# EAGLE design SmartPwm_v1 (EAGLE 9.6.2)
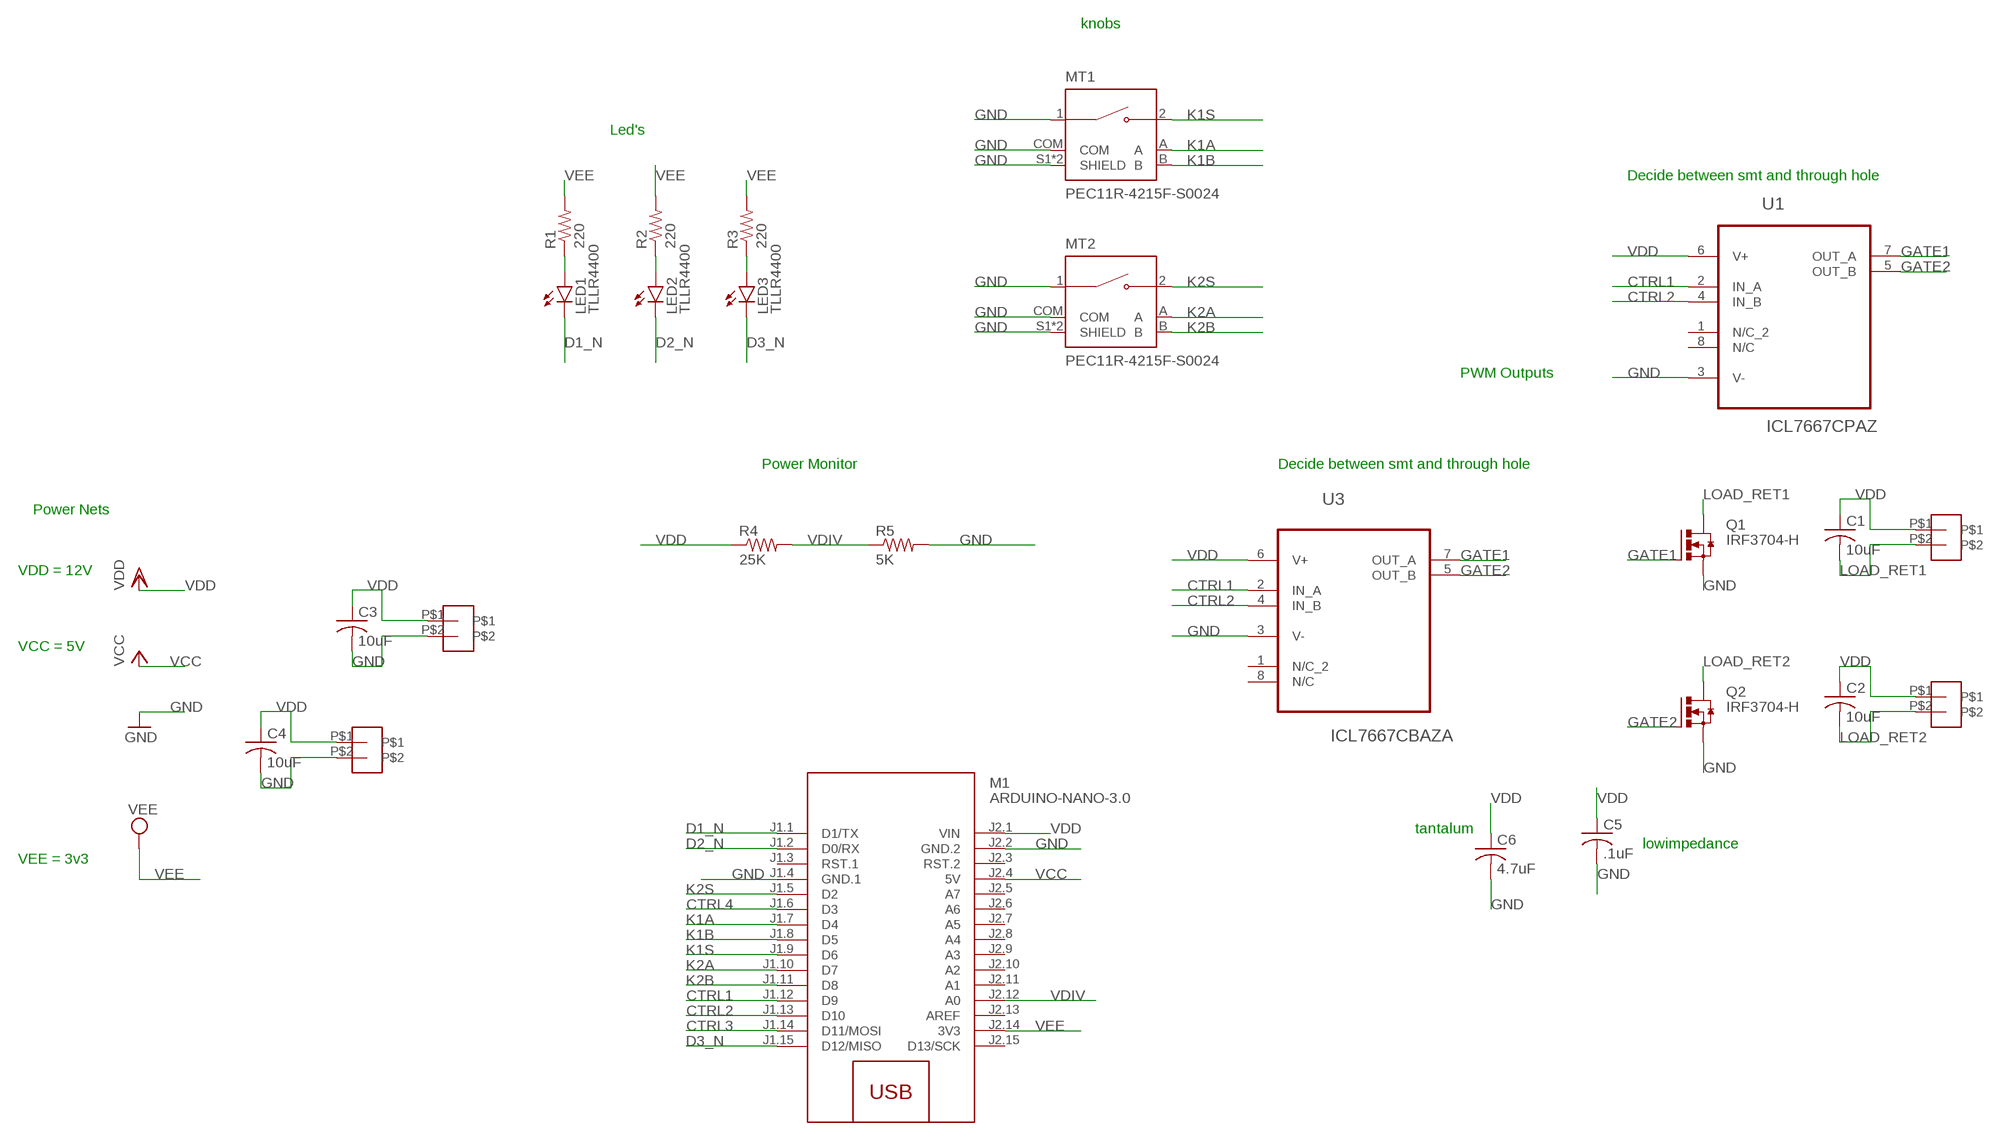
[diagram p0: schematic, sheet 1]

## Parts
C1  10uF  C-US025-024X044  [C025-024X044]
C2  10uF  C-US025-024X044  [C025-024X044]
C3  10uF  C-US025-024X044  [C025-024X044]
C4  10uF  C-US025-024X044  [C025-024X044]
C5  .1uF  C-US025-024X044  [C025-024X044]
C6  4.7uF  C-US025-024X044  [C025-024X044]
LED1  TLLR4400  [LED3MM]
LED2  TLLR4400  [LED3MM]
LED3  TLLR4400  [LED3MM]
M1  ARDUINO-NANO-3.0  [ARDUINO-NANO-3.0]
MT1  PEC11R-4215F-S0024  [XDCR_PEC11R-4215F-S0024]
MT2  PEC11R-4215F-S0024  [XDCR_PEC11R-4215F-S0024]
Q1  IRF3704-H  [TO220BH]
Q2  IRF3704-H  [TO220BH]
R1  220  R-US_0207/10  [0207/10]
R2  220  R-US_0207/10  [0207/10]
R3  220  R-US_0207/10  [0207/10]
R4  25K  R-US_0207/10  [0207/10]
R5  5K  R-US_0207/10  [0207/10]
U1  ICL7667CPAZ  [DIP254P762X533-8]
U3  ICL7667CBAZA  [SOIC127P600X175-8N]
U$1  TB002-500-P02  [TB002-500-P02]
U$2  TB002-500-P02  [TB002-500-P02]
U$5  TB002-500-P02  [TB002-500-P02]
U$8  TB002-500-P02  [TB002-500-P02]

## Nets
CTRL1: M1.J1.12(D9) U1.2(IN_A) U3.2(IN_A)
CTRL2: M1.J1.13(D10) U1.4(IN_B) U3.4(IN_B)
CTRL3: M1.J1.14(D11/MOSI)
CTRL4: M1.J1.6(D3)
D1_N: LED1.K(C) M1.J1.1(D1/TX)
D2_N: LED2.K(C) M1.J1.2(D0/RX)
D3_N: LED3.K(C) M1.J1.15(D12/MISO)
GATE1: Q1.G U1.7(OUT_A) U3.7(OUT_A)
GATE2: Q2.G U1.5(OUT_B) U3.5(OUT_B)
GND: C3.2 C4.2 C5.2 C6.2 M1.J1.4(GND.1) M1.J2.2(GND.2) MT1.1 MT1.COM MT1.S1(SHIELD) MT1.S2(SHIELD) MT2.1 MT2.COM MT2.S1(SHIELD) MT2.S2(SHIELD) Q1.S Q2.S R5.2 U1.3(V-) U3.3(V-) U$5.P$2 U$8.P$2
K1A: M1.J1.7(D4) MT1.A
K1B: M1.J1.8(D5) MT1.B
K1S: M1.J1.9(D6) MT1.2
K2A: M1.J1.10(D7) MT2.A
K2B: M1.J1.11(D8) MT2.B
K2S: M1.J1.5(D2) MT2.2
LOAD_RET1: C1.2 Q1.D U$1.P$2
LOAD_RET2: C2.2 Q2.D U$2.P$2
N$1: LED1.A R1.1
N$2: LED2.A R2.1
N$3: LED3.A R3.1
VCC: M1.J2.4(5V)
VDD: C1.1 C2.1 C3.1 C4.1 C5.1 C6.1 M1.J2.1(VIN) R4.1 U1.6(V+) U3.6(V+) U$1.P$1 U$2.P$1 U$5.P$1 U$8.P$1
VDIV: M1.J2.12(A0) R4.2 R5.1
VEE: M1.J2.14(3V3) R1.2 R2.2 R3.2
Unconnected: M1.J1.3(RST.1) M1.J2.3(RST.2) M1.J2.5(A7) M1.J2.6(A6) M1.J2.7(A5) M1.J2.8(A4) M1.J2.9(A3) M1.J2.10(A2) M1.J2.11(A1) M1.J2.13(AREF) M1.J2.15(D13/SCK) U1.1(N/C_2) U1.8(N/C) U3.1(N/C_2) U3.8(N/C)

## Notes on the sheet
- knobs
- Led's
- Decide between smt and through hole
- PWM Outputs
- Power Monitor | Decide between smt and through hole
- Power Nets
- VDD = 12V
- VCC = 5V
- tantalum
- lowimpedance
- VEE = 3v3

## Library data of the parts
C1-C6 = rcl:C-US: CAPACITOR, American symbol; SPICEPREFIX: C
LED1-LED3 = led:TLLR4400: Low Current (2mA) LED 3 mm Tinted Diffused Package color RED Source: Data sheet <http://www.farnell.com/datasheets/391100.pdf>; MF: VISHAY SEMICONDUCTOR; OC_FARNELL: 1612437
M1 = diy-modules:ARDUINO-NANO-3.0: Arduino Nano 3.0 and compatible devices More details available here: https://www.arduino.cc/en/Main/ArduinoBoardNano Click here to find device on ebay.com <http://www.ebay.com/sch/arduino+nano>
MT1 MT2 = PEC11R-4215F-S0024:PEC11R-4215F-S0024: Incremental Encoder, 12 Mm, Contact Rating 10 Ma - 5 Vdc Check prices <https://pricing.snapeda.com/parts/PEC11R-4215F-S0024/Bourns/view-part?ref=eda>; AVAILABILITY: In Stock; DESCRIPTION: Rotary Encoder Mechanical 24 Quadrature (Incremental) Vertical; MF: Bourns; MP: PEC11R-4215F-S0024; PACKAGE: None; PRICE: None; PURCHASE-URL: https://pricing.snapeda.com/search/part/PEC11R-4215F-S0024/?ref=eda
Q1 Q2 = transistor-power:IRF3704: SMPS MOSFET HEXFET® Power MOSFET Source: http://www.irf.com/product-info/datasheets/data/irf3704.pdf
R1-R5 = rcl:R-US_: RESISTOR, American symbol; SPICEPREFIX: R
U1 = ICL7667CPAZ:ICL7667CPAZ: Dual Power MOSFET Driver Check prices <https://pricing.snapeda.com/parts/ICL7667CPAZ/Renesas%20Electronics%20America%20Inc/view-part?ref=eda>; AVAILABILITY: In Stock; DESCRIPTION: High-Side or Low-Side Gate Driver IC Inverting 8-PDIP; MF: Renesas Electronics America Inc; MP: ICL7667CPAZ; PACKAGE: DIP-8 Renesas / Intersil; PRICE: None; PURCHASE-URL: https://pricing.snapeda.com/search/part/ICL7667CPAZ/?ref=eda
U3 = ICL7667CBAZA:ICL7667CBAZA: Dual Power MOSFET Driver Check prices <https://pricing.snapeda.com/parts/ICL7667CBAZA/Renesas%20Electronics%20America%20Inc/view-part?ref=eda>; AVAILABILITY: In Stock; DESCRIPTION: High-Side or Low-Side Gate Driver IC Inverting 8-SOIC; MF: Renesas Electronics America Inc; MP: ICL7667CBAZA; PACKAGE: SOIC-8 Renesas Electronics; PRICE: None; PURCHASE-URL: https://pricing.snapeda.com/search/part/ICL7667CBAZA/?ref=eda
U$1 U$2 U$5 U$8 = mylib:TB002-500-P02: Terminal Block. Screw Connection. Two Pole.

## Board
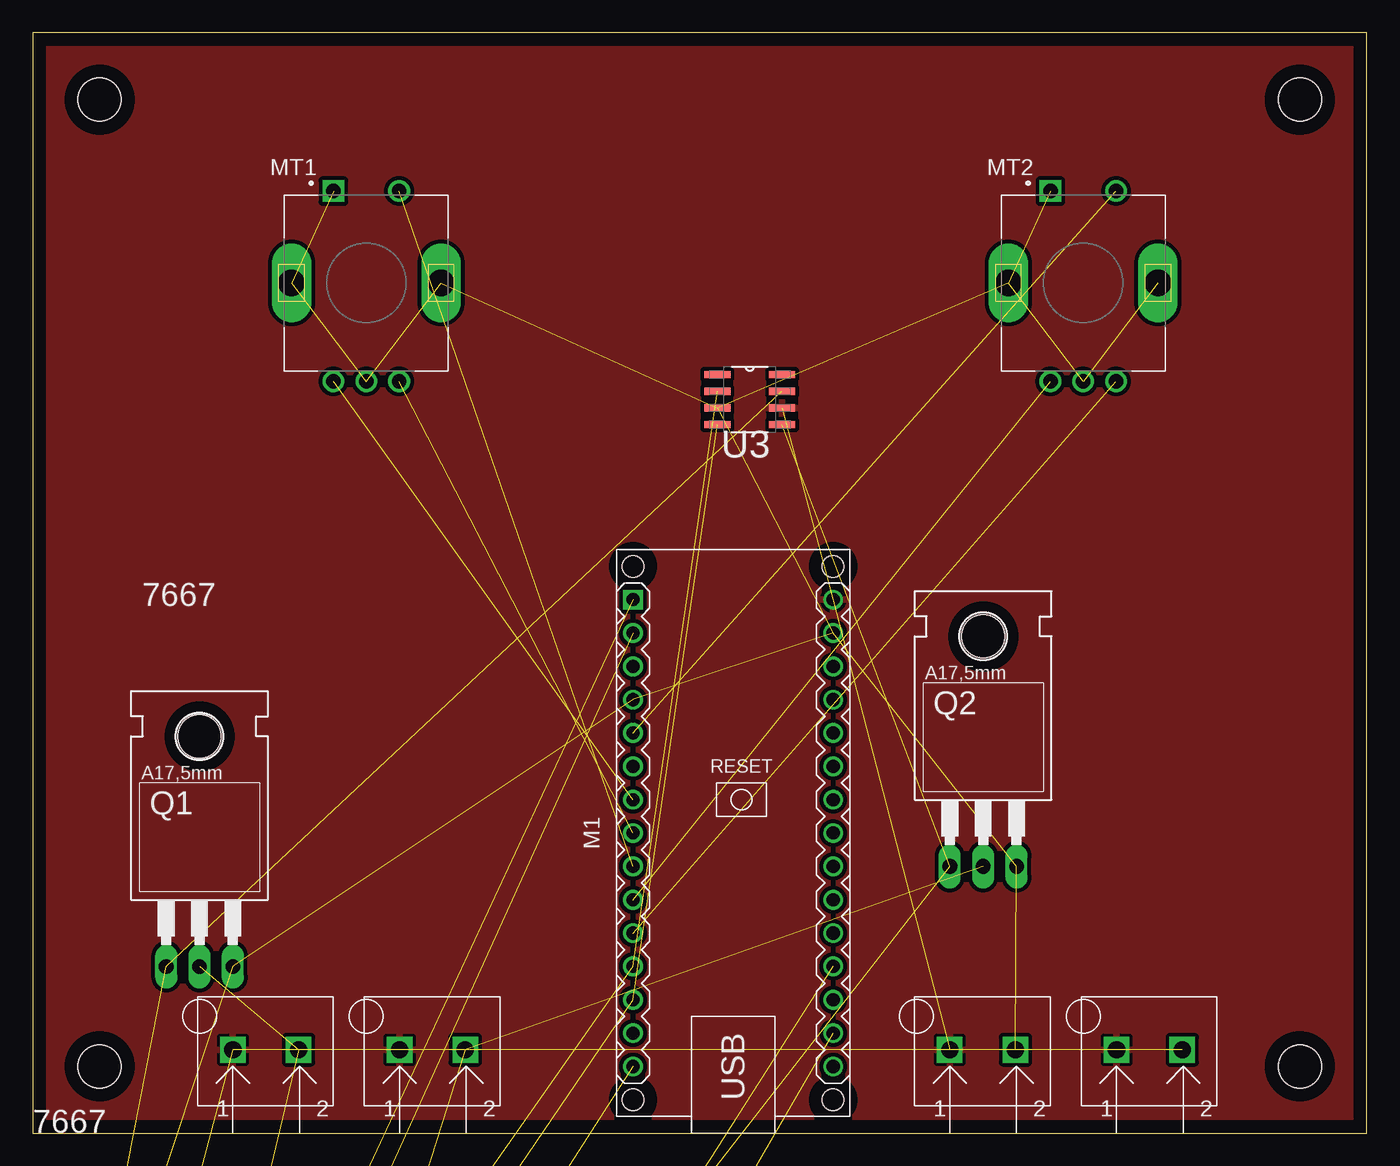
[diagram p1: board, top side]
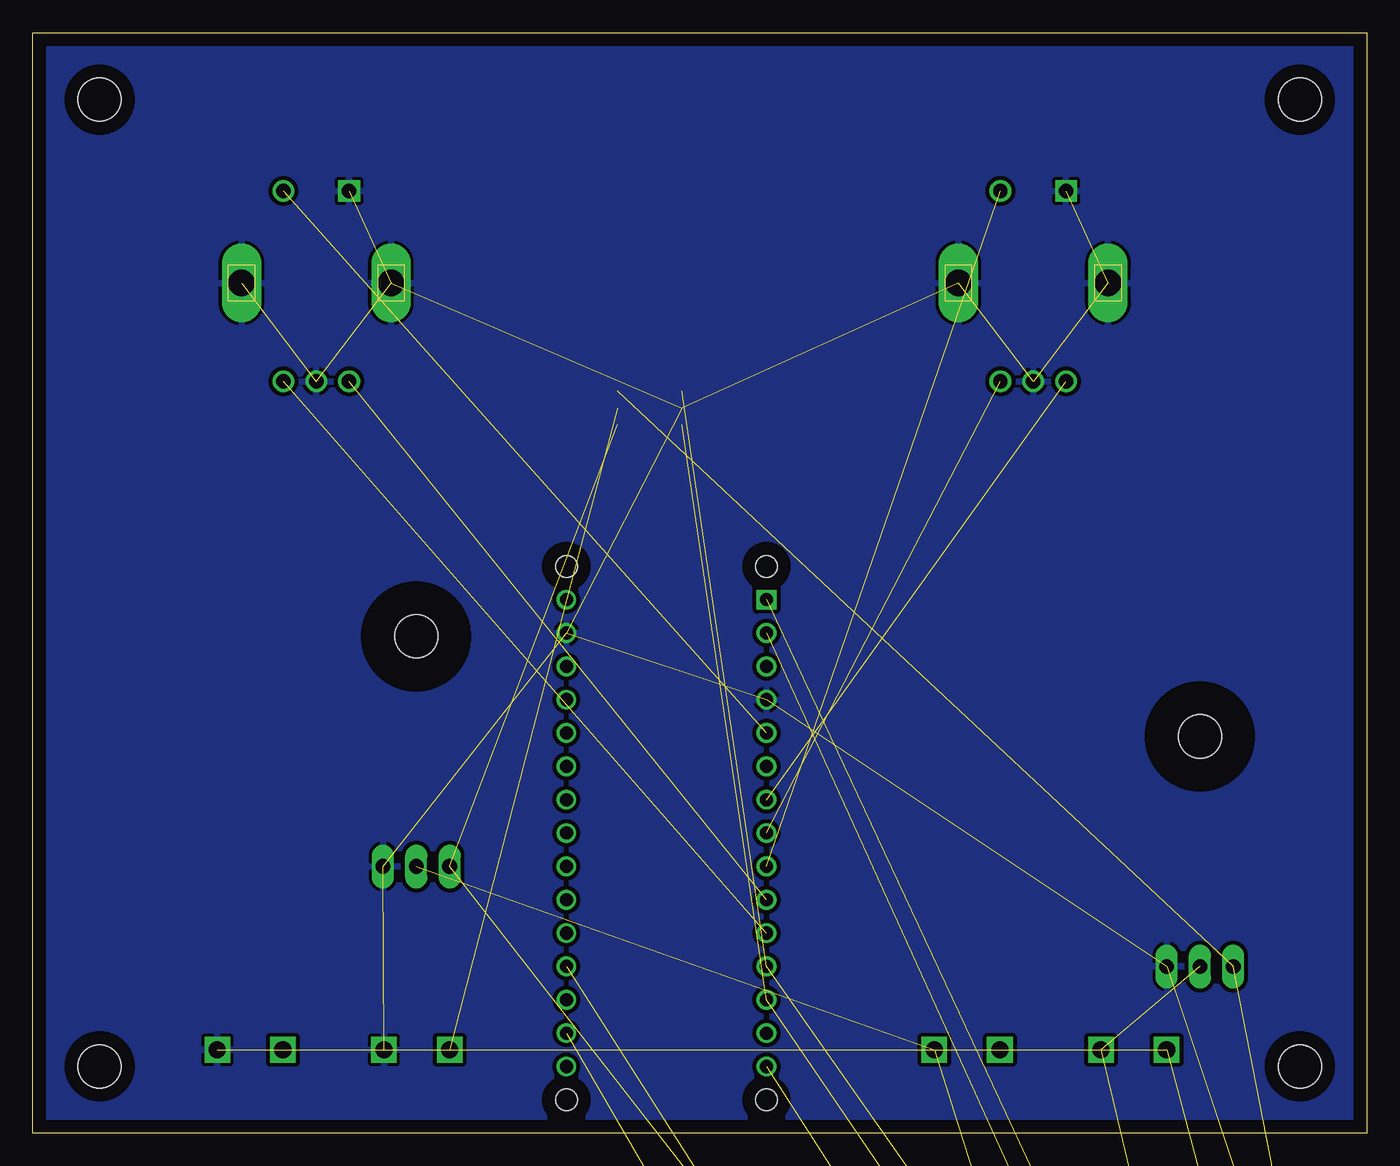
[diagram p2: board, bottom side, seen from below]

Size 101.6 x 83.82 mm. Coordinates in mm from the lower left corner, seen from the top.
Outline: 0,0 101.6,0 101.6,83.82 0,83.82 0,0
Copper layers (1*16): Top 0.035mm / dielectric 1.5mm / Bottom 0.035mm
Design rules "default *": minimum track width 10mil, minimum drill 0.35mm, track to track 12mil, track to pad 12mil, pad to pad 12mil, via to via 12mil, smd to smd 6mil, copper to edge 40mil, drill to drill 12mil, minimum pad ring 10mil, minimum via ring 8mil, stop-mask expansion 4mil, vias tented up to drill 0mil, thermal gap 10mil
Holes 3.3 mm at 5.08,78.74 5.08,5.08 96.52,5.08 96.52,78.74
vRestrict: area 0.9,0.9 to 9.3,9.3; area 92.3,0.9 to 100.7,9.3; area 0.9,74.5 to 9.3,82.9; area 92.3,74.5 to 100.7,82.9

### Footprints (pad centres in the part's own frame; a part is rotated, then mirrored left to right if it is on the bottom)
C025-024X044 = drill 0.813 octagon: 1 -1.27,0; 2 1.27,0
LED3MM = drill 0.813 octagon: A -1.27,0; K 1.27,0
ARDUINO-NANO-3.0 = drill 1 square: J1.1 17.78,7.62 | drill 1: J1.2 15.24,7.62; J1.3 12.7,7.62; J1.4 10.16,7.62; J1.5 7.62,7.62; J1.6 5.08,7.62; J1.7 2.54,7.62; J1.8 0,7.62; J1.9 -2.54,7.62; J1.10 -5.08,7.62; J1.11 -7.62,7.62; J1.12 -10.16,7.62; J1.13 -12.7,7.62; J1.14 -15.24,7.62; J1.15 -17.78,7.62; J2.1 17.78,-7.62; J2.2 15.24,-7.62; J2.3 12.7,-7.62; J2.4 10.16,-7.62; J2.5 7.62,-7.62; J2.6 5.08,-7.62; J2.7 2.54,-7.62; J2.8 0,-7.62; J2.9 -2.54,-7.62; J2.10 -5.08,-7.62; J2.11 -7.62,-7.62; J2.12 -10.16,-7.62; J2.13 -12.7,-7.62; J2.14 -15.24,-7.62; J2.15 -17.78,-7.62 | hole 1.651: -20.32,7.62; -20.32,-7.62; 20.32,-7.62; 20.32,7.62
XDCR_PEC11R-4215F-S0024 = drill 1.1 square: 1 -2.5,7 | drill 1.1: 2 2.5,7; A -2.5,-7.5; B 2.5,-7.5; COM 0,-7.5 | drill 2 long: S1 -5.7,0; S2 5.7,0
TO220BH = drill 1.118 long: D 0,-6.35; G -2.54,-6.35; S 2.54,-6.35 | hole 3.302: 0,11.176
0207/10 = drill 0.813 octagon: 1 -5.08,0; 2 5.08,0
DIP254P762X533-8 = drill 1.118 square: 1 -7.62,7.62 | drill 1.118: 2 -7.62,5.08; 3 -7.62,2.54; 4 -7.62,0; 5 0,0; 6 0,2.54; 7 0,5.08; 8 0,7.62
SOIC127P600X175-8N = smd 1.981 x 0.559: 1 -2.464,1.905; 2 -2.464,0.635; 3 -2.464,-0.635; 4 -2.464,-1.905; 5 2.464,-1.905; 6 2.464,-0.635; 7 2.464,0.635; 8 2.464,1.905
TB002-500-P02 = drill 1.3 square: P$1 0,0; P$2 5,0

### Placement (x,y rotation side)
C1  -12.7,-127 0 top  (outside the outline)
C2  -12.7,-134.62 0 top  (outside the outline)
C3  -12.7,-119.38 0 top  (outside the outline)
C4  -12.7,-142.24 0 top  (outside the outline)
C5  -12.7,-149.86 0 top  (outside the outline)
C6  -12.7,-157.48 0 top  (outside the outline)
LED1  1.27,-52.07 0 top  (outside the outline)
LED2  1.27,-57.15 0 top  (outside the outline)
LED3  1.27,-62.23 0 top  (outside the outline)
M1  53.34,22.86 90 top
MT1  25.4,64.77 0 top
MT2  80.01,64.77 0 top
Q1  12.7,19.05 0 top
Q2  72.39,26.67 0 top
R1  -8.89,-104.14 0 top  (outside the outline)
R2  -8.89,-109.22 0 top  (outside the outline)
R3  -8.89,-114.3 0 top  (outside the outline)
R4  -8.89,-88.9 0 top  (outside the outline)
R5  -8.89,-93.98 0 top  (outside the outline)
U1  -6.35,-77.47 0 top  (outside the outline)
U3  54.61,55.88 0 top
U$1  15.24,6.35 0 top
U$2  27.94,6.35 0 top
U$5  69.85,6.35 0 top
U$8  82.55,6.35 0 top

### Tracks (layer width: path | path; a pad name or v marks a point on that pad's centre or on a via)
CTRL1  (2 unrouted)
CTRL2  (2 unrouted)
D1_N  (1 unrouted)
D2_N  (1 unrouted)
D3_N  (1 unrouted)
GATE1  (2 unrouted)
GATE2  (2 unrouted)
GND  (20 unrouted)
  pour Bottom: 0,90.17 0,-5.08 1.27,-6.35 101.6,-6.35 105.41,-2.54 105.41,87.63 109.22,91.44 1.27,91.44
K1A  (1 unrouted)
K1B  (1 unrouted)
K1S  (1 unrouted)
K2A  (1 unrouted)
K2B  (1 unrouted)
K2S  (1 unrouted)
LOAD_RET1  (2 unrouted)
LOAD_RET2  (2 unrouted)
N$1  (1 unrouted)
N$2  (1 unrouted)
N$3  (1 unrouted)
VDD  (13 unrouted)
  pour Top: -1.27,86.36 104.14,86.36 104.14,0 102.87,-1.27 1.27,-1.27 0,0 0,85.09
VDIV  (2 unrouted)
VEE  (3 unrouted)

### Text on the board
tPlace: 7667 | 7667